# Altium schematic sheet P1.schdoc
size 297 x 209 mm; Symbol: Drawing-Symbol_A4; @Project Name: ScaleCard; @Page Count: 1; @Update Date: 2026-07-02; @Create Date: 2026-07-02; @Schematic Name: Schematic1; @Page No: 1; @Page Name: P1; Company: EasyEDA.com; Version: V1.0; Page Size: A4; Device: Drawing-Symbol_A4; @Create Time: 15:44:18; @Update Time: 15:44:18; Border: 1; Width: 1170; Height: 825; Region Start: 1; X Region Count: 6; Y Region Count: 4; Blade Width: 10; Title Block Position: 3; @Board Name: Board1
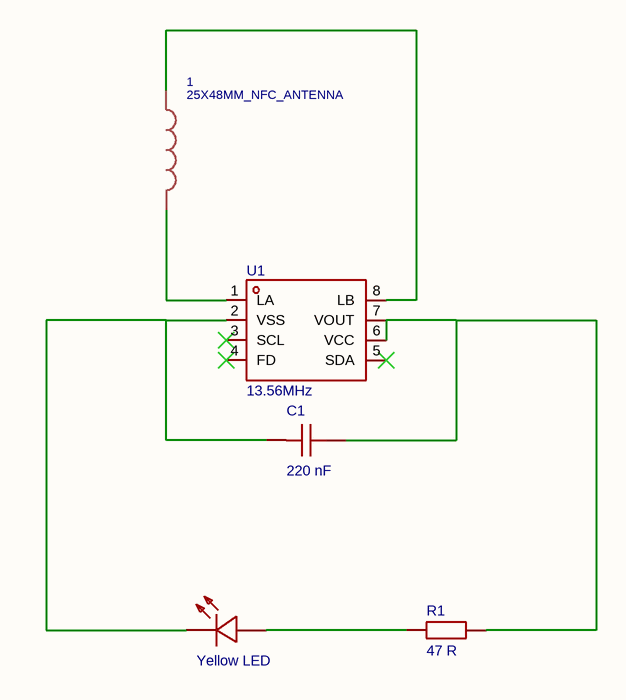
[diagram p0: P1.schdoc]

## Parts
1  25X48MM_NFC_ANTENNA  [25X48MM_NFC_ANTENNA]
C1  220 nF  [C0603]
LED1  Yellow LED  [LED0603-R-RD]
R1  47 R  [R0603]
U1  13.56MHz  [XQFN-8_L1.6-W1.6-P0.50-BL_NT3H2111W0FHKH]

## Nets
Net1_P$1: 1.P$1 U1.8(LB)
Net1_P$2: 1.P$2 U1.1(LA)
NetC1_1: C1.1 R1.2 U1.6(VCC) U1.7(VOUT)
NetC1_2: C1.2 LED1.2(K) U1.2(VSS)
NetLED1_1: LED1.1(A) R1.1

Not connected (* = marked no-connect by the designer): U1 3(SCL)* 4(FD)* 5(SDA)*

## Notes on the sheet
- Create at
- 2026-07-02
- Schematic
- Board
- Schematic1
- Board1
- Update at
- Page
- P1
- Drawn
- Reviewed
- ScaleCard
- Version
- V1.0
- Size
- A4
- Page  1  Total  1
- EasyEDA.com

## Library data of the parts
C1 = CAP_0603: Symbol: CAP; ConvertToPcb: yes; ModelId: 624118aa3cc7497086c383c2d72e08520819f05c4eef4c71ace90d822a990e87; ModelName: C0603_L1.6-W0.8-H0.8; ModelTransform: 62.992,31.496,0,0,0,0,0,0,0; Device: CAP_0603; Value: 220 nF; AddInBom: yes; Supplier Footprint: 0603; FootprintName: C0603
LED1 = Yellow LED: Manufacturer: KENTO; ManufacturerPart: KT-0603R; ConvertToPcb: yes; ModelId: 071a1a3a4e0c4c6c9cbfc84cfa70f6d7e6ab44e7981244f9a09eab8f9c412657; Symbol: Yellow LED; Device: Yellow LED; Supplier: LCSC; SupplierPart: C2286; JLCPCB Part Class: Basic Part; AddInBom: yes; ModelName: LED0603-R-RD; FootprintName: LED0603-R-RD
R1 = Res_0603: Symbol: Res; ConvertToPcb: yes; ModelId: 112863783b5b41f1b5254f87eedc79320819f05c4eef4c71ace90d822a990e87; ModelTransform: 31.8897,63.7794,0,90,0,0,0,0,0; Device: Res_0603; Value: 47 R; AddInBom: yes; Supplier Footprint: 0603; FootprintName: R0603; ModelName: R0603
U1 = NT3H2111W0FHKH: agreement:ISO 14443 interface type:I2C Frequency:13.56MHz Frequency:13.56MHz mains input:3.3V mains input:3.3V; Manufacturer: NXP(恩智浦); AddInBom: yes; interface type: I2C; mains input: 3.3V; Symbol: NT3H2111W0FHKH; Device: NT3H2111W0FHKH; LCSC Part Name: NT3H2111W0FHKH; SupplierPart: C710403; ManufacturerPart: NT3H2111W0FHKH; Supplier Footprint: XQFN-8(1.6x1.6); JLCPCB Part Class: Extended Part; Datasheet: https://www.nxp.com/docs/en/data-sheet/NT3H2111_2211.pdf; Supplier: LCSC; ConvertToPcb: yes; FootprintName: XQFN-8_L1.6-W1.6-P0.50-BL_NT3H2111W0FHKH; agreement: ISO 14443; Value: 13.56MHz
1 = 25X48MM_NFC_ANTENNA: Symbol: 25X48MM_NFC_ANTENNA; Device: 25X48MM_NFC_ANTENNA; OriginFootprint: 25X48MM_NFC_ANTENNA; FootprintName: 25X48MM_NFC_ANTENNA